# Altium schematic sheet etapa3_v1_timing_1.SchDoc
size A4
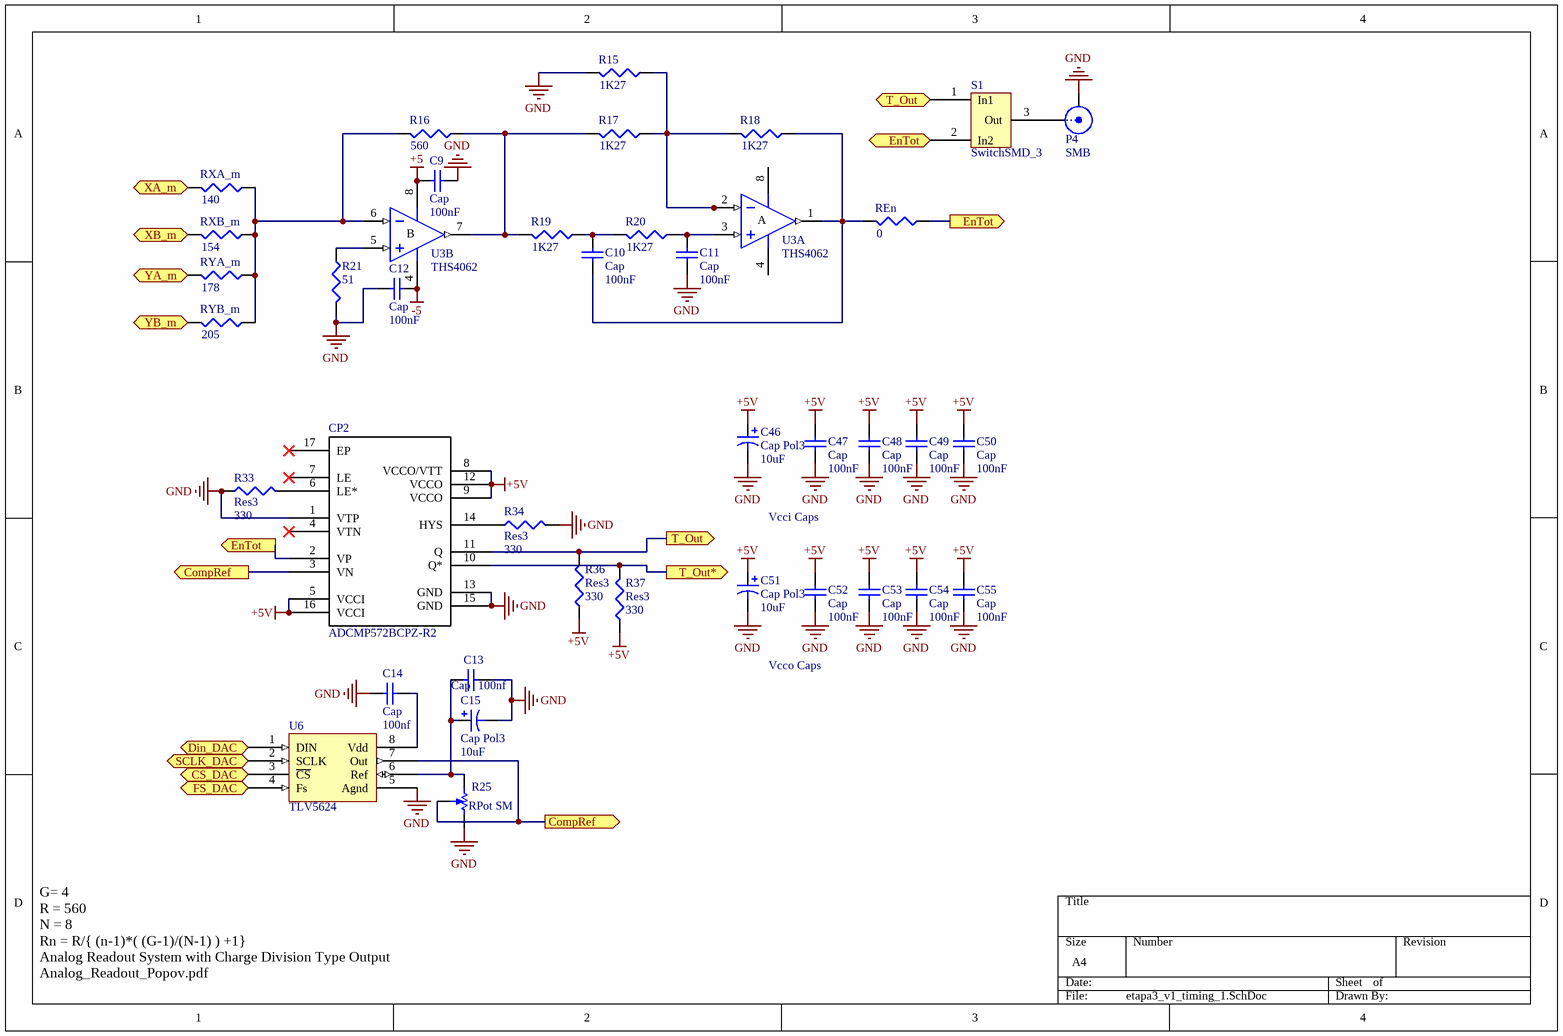
[diagram p0: etapa3_v1_timing_1.SchDoc]

## Parts
C9  Cap  value 100nF  [0402]
C10  Cap  value 100nF  [0402]
C11  Cap  value 100nF  [0402]
C12  Cap  value 100nF  [0402]
C13  Cap  value 100nf  [J1-0603]
C14  Cap  value 100nf  [J1-0603]
C15  Cap Pol3  value 10uF  [6-0805_N]
C46  Cap Pol3  value 10uF  [1608[0603]]
C47  Cap  value 100nF  [0402]
C48  Cap  value 100nF  [0402]
C49  Cap  value 100nF  [0402]
C50  Cap  value 100nF  [0402]
C51  Cap Pol3  value 10uF  [1608[0603]]
C52  Cap  value 100nF  [0402]
C53  Cap  value 100nF  [0402]
C54  Cap  value 100nF  [0402]
C55  Cap  value 100nF  [0402]
CP2  ADCMP572BCPZ-R2  [CP_16_3]
P4  SMB  [SMA-SMD]
R15  value 1K27  [0402]  (hidden comment: Res3)
R16  value 560  [0402]  (hidden comment: Res3)
R17  value 1K27  [0402]  (hidden comment: Res3)
R18  value 1K27  [0402]  (hidden comment: Res3)
R19  value 1K27  [0402]  (hidden comment: Res3)
R20  value 1K27  [0402]  (hidden comment: Res3)
R21  value 51  [0402]  (hidden comment: Res3)
R25  RPot SM  [POT4MM-2]
R33  Res3  value 330  [0402]
R34  Res3  value 330  [0402]
R36  Res3  value 330  [0402]
R37  Res3  value 330  [0402]
REn  value 0  [0402]  (hidden comment: Res3)
RXA_m  value 140  [0402]  (hidden comment: Res3)
RXB_m  value 154  [0402]  (hidden comment: Res3)
RYA_m  value 178  [0402]  (hidden comment: Res3)
RYB_m  value 205  [0402]  (hidden comment: Res3)
S1  SwitchSMD_3  [SwitchSMD_0603]
U3  THS4062  [SO-8_M]  (parts A,B of 2)
U6  TLV5624  [SO-8_N]

## Ports
CompRef (out), CS_DAC (out), Din_DAC (out), EnTot (out), FS_DAC (out), SCLK_DAC (out), T_Out (out), T_Out* (out), XA_m (out), XB_m (out), YA_m (out), YB_m (out)

## Nets
+5: C9.1 U3.8(V+)
+5V: C46.1 C47.2 C48.2 C49.2 C50.2 C51.1 C52.2 C53.2 C54.2 C55.2 CP2.5(VCCI) CP2.8(VCCO/VTT) CP2.9(VCCO) CP2.12(VCCO) CP2.16(VCCI) R36.1 R37.1
-5: C12.2 U3.4(V-)
GND: C9.2 C11.2 C12.1 C13.2 C14.2 C15.2 C46.2 C47.1 C48.1 C49.1 C50.1 C51.2 C52.1 C53.1 C54.1 C55.1 CP2.1(VTP) CP2.13(GND) CP2.15(GND) P4.2(Y) R15.2 R21.2 R25.CW(+) R33.1 R34.2 U6.5(Agnd)
CompRef: CP2.3(VN) R25.W U6.7(Out) ; port CompRef
CS_DAC: U6.3(~{CS}) ; port CS_DAC
Din_DAC: U6.1(DIN) ; port Din_DAC
EnTot: CP2.2(VP) REn.1 S1.2(In2) ; port EnTot
FS_DAC: U6.4(Fs) ; port FS_DAC
SCLK_DAC: U6.2(SCLK) ; port SCLK_DAC
T_Out: CP2.11(Q) R36.2 S1.1(In1) ; port T_Out
T_Out*: CP2.10(Q*) R37.2 ; port T_Out*
XA_m: RXA_m.2 ; port XA_m
XB_m: RXB_m.2 ; port XB_m
YA_m: RYA_m.2 ; port YA_m
YB_m: RYB_m.2 ; port YB_m
NetC10_1: C10.1 R19.1 R20.2
NetC10_2: C10.2 R18.1 REn.2 U3.1(OUT)
NetC11_1: C11.1 R20.1 U3.3(IN+)
NetC13_1: C13.1 C15.1 R25.CCW(-) U6.6(Ref)
NetC14_1: C14.1 U6.8(Vdd)
NetCP2_6: CP2.6(LE*) R33.2
NetCP2_14: CP2.14(HYS) R34.1
NetP4_1: P4.1(X) S1.3(Out)
NetR15_1: R15.1 R17.1 R18.2 U3.2(IN-)
NetR16_1: R16.1 R17.2 R19.2 U3.7(OUT)
NetR16_2: R16.2 RXA_m.1 RXB_m.1 RYA_m.1 RYB_m.1 U3.6(IN-)
NetR21_1: R21.1 U3.5(IN+)

Not connected (* = marked no-connect by the designer): CP2 4(VTN)* 7(LE)* 17(EP)*

## Notes on the sheet
- Vcci Caps
- Vcco Caps
- G= 4
  R = 560
  N = 8
  Rn = R/{ (n-1)*( (G-1)/(N-1) ) +1}
  Analog Readout System with Charge Division Type Output
  Analog_Readout_Popov.pdf
- (in symbol AD8002AR, part A) A
- (in symbol AD8002AR, part B) B

## Library data of the parts
C9-C14 C47-C50 C52-C55 = Cap: Capacitor; Published: 8-Jun-2000; LatestRevisionDate: 17-Jul-2002; LatestRevisionNote: Re-released for DXP Platform.; PackageReference: RAD-0.3; Publisher: Altium Limited; PackageDescription: Radial Cap, Thru-Hole; 2 Leads; 0.3 in Pin Spacing
C15 C46 C51 = Cap Pol3: Polarized Capacitor (Surface Mount); Published: 8-Jun-2000; LatestRevisionDate: 29-May-2009; LatestRevisionNote: IPC-7351 Footprint Added.; PackageReference: C0805; Publisher: Altium Limited; PackageDescription: Chip Capacitor
CP2 = ADCMP572BCPZ-R2: Imported; Manufacturer_Part_Number: ADCMP572BCPZ-R2; Vendor: Vendor; RefDes: RefDes; Type: DEV; Value: Value
P4 = SMB: SMB Straight Connector; LatestRevisionDate: 17-Jul-2002; LatestRevisionNote: Re-released for DXP Platform.; Publisher: Altium Limited
R15-R21 R33 R34 R36 R37 REn RXA_m RXB_m RYA_m RYB_m = Res3: Resistor; Published: 8-Jun-2000; LatestRevisionDate: 29-May-2009; LatestRevisionNote: IPC-7351 Footprint Added.; PackageReference: J1-0603; Publisher: Altium Limited; PackageDescription: Chip Resistor
R25 = RPot SM: Square Trimming Potentiometer; Published: 17-Dec-2003; DatasheetVersion: Oct-2003; PackageReference: POT4MM-2; Publisher: Altium Limited; PackageDescription: Square Trimming Potentiometer; ComponentLink1Description: Manufacturer Link; ComponentLink1URL: http://bourns.com/2/search.html
U3 = AD8002AR: Dual 600MHz, 50mW Current Feedback Amplifier; Published: 8-Jun-2000; LatestRevisionDate: 13-Apr-2006; LatestRevisionNote: IPC-7351 Footprint Added.; DatasheetVersion: REV. C 1999; PackageVersion: revA; PackageReference: SO-8; Publisher: Altium Limited; PackageDescription: 8-Pin Small Outline Integrated Circuit 1.27 mm Pitch; Code_JEDEC: MS-012-AA; Code_IPC: SOIC127P600-8; ComponentLink1Description: Manufacturer Link; ComponentLink1URL: http://www.analog.com/en/prod/0,,759_786_AD8002%2C00.html; ComponentLink2Description: Datasheet; ComponentLink2URL: http://www.analog.com/UploadedFiles/Data_Sheets/147523773AD8002_d.pdf
U6 = TLV5624: DAC, internal reference, SPI